# EAGLE design LilyPad-Dev-Simple-v12 (EAGLE 6.2)

## Sheet 1 of 2
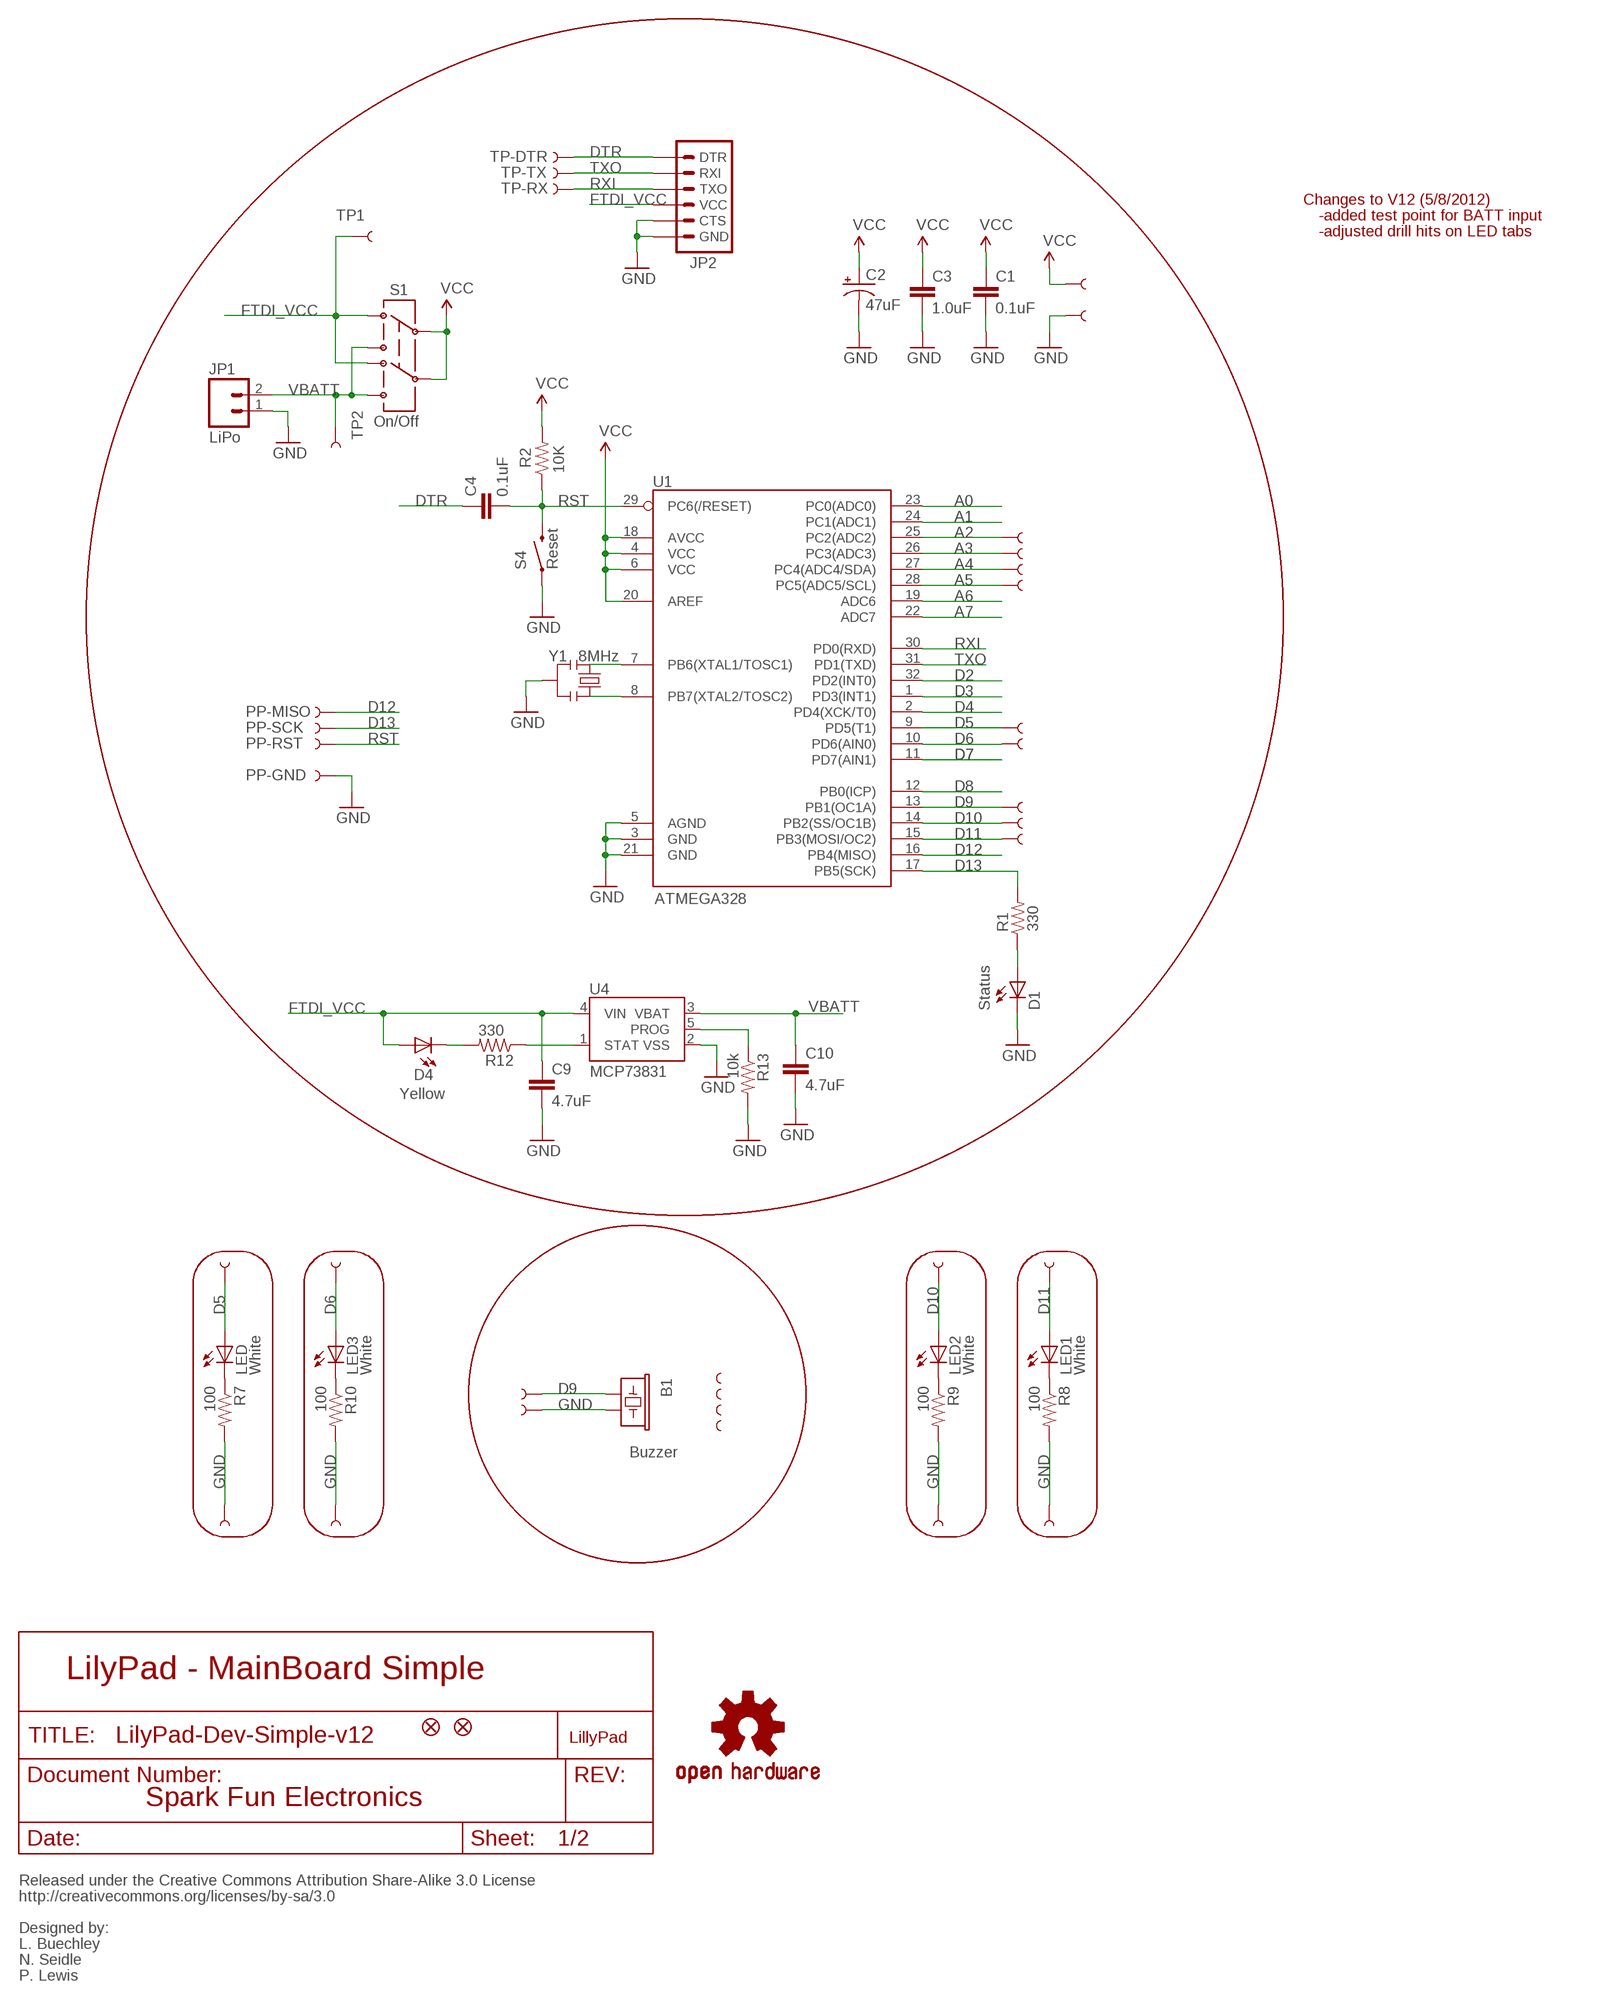
[diagram p0: schematic, sheet 1]

### Parts
1  SEWTAP-NOHOLE2  [PETAL-NOHOLE-2SIDE]
2  SEWTAP-NOHOLE2  [PETAL-NOHOLE-2SIDE]
3  SEWTAP-NOHOLE2  [PETAL-NOHOLE-2SIDE]
4  SEWTAP-NOHOLE2  [PETAL-NOHOLE-2SIDE]
A2/16  SEWTAP9  [PETAL-LONG-1-2SIDE]
A3/17  SEWTAP9  [PETAL-LONG-1-2SIDE]
A4/18  SEWTAP9  [PETAL-LONG-1-2SIDE]
A5/19  SEWTAP9  [PETAL-LONG-1-2SIDE]
B1  Buzzer  BUZZERSMD2  [BUZZER-CCV]
C1  0.1uF  CAP0402-CAP  [0402-CAP]
C2  47uF  CAP_POL3528  [EIA3528]
C3  1.0uF  CAP0402-CAP  [0402-CAP]
C4  0.1uF  CAP0402-CAP  [0402-CAP]
C9  4.7uF  CAP0402-CAP  [0402-CAP]
C10  4.7uF  CAP0402-CAP  [0402-CAP]
D1  Status  LED0603  [LED-0603]
D4  Yellow  LED0603  [LED-0603]
JP1  LiPo  M02-JST-2MM-SMT  [JST-2-SMD]
JP2  ARDUINO_SERIAL_PROGRAMSMD  [1X06-SMD]
JP3  FIDUCIAL1X2  [FIDUCIAL-1X2]
JP4  FIDUCIAL1X2  [FIDUCIAL-1X2]
LED  White  LED1206  [LED-1206]
LED1  White  LED1206  [LED-1206]
LED2  White  LED1206  [LED-1206]
LED3  White  LED1206  [LED-1206]
LED+  SEWTAP6  [PETAL-SMALL-2SIDE]
LED+1  SEWTAP6  [PETAL-SMALL-2SIDE]
LED+2  SEWTAP6  [PETAL-SMALL-2SIDE]
LED+3  SEWTAP6  [PETAL-SMALL-2SIDE]
LED-  SEWTAP6  [PETAL-SMALL-2SIDE]
LED-1  SEWTAP6  [PETAL-SMALL-2SIDE]
LED-2  SEWTAP6  [PETAL-SMALL-2SIDE]
LED-3  SEWTAP6  [PETAL-SMALL-2SIDE]
LOGO  LOGO-LPLPA  [LOGO-LPA]
PP-GND  TEST-POINT3X5  [PAD.03X.05]
PP-MISO  TEST-POINT3X5  [PAD.03X.05]
PP-RST  TEST-POINT3X5  [PAD.03X.05]
PP-SCK  TEST-POINT3X5  [PAD.03X.05]
R1  330  RESISTOR0402-RES  [0402-RES]
R2  10K  RESISTOR0402-RES  [0402-RES]
R7  100  RESISTOR0603-RES  [0603-RES]
R8  100  RESISTOR0603-RES  [0603-RES]
R9  100  RESISTOR0603-RES  [0603-RES]
R10  100  RESISTOR0603-RES  [0603-RES]
R12  330  RESISTOR0402-RES  [0402-RES]
R13  10k  RESISTOR0402-RES  [0402-RES]
S1  On/Off  AYZ0202  [AYZ0202]
S4  Reset  SWITCH-MOMENTARY-2SMD  [TACTILE_SWITCH_SMD]
TP1  TEST-POINT3X5  [PAD.03X.05]
TP2  TEST-POINT3X5  [PAD.03X.05]
TP-DTR  TEST-POINT3X5  [PAD.03X.05]
TP-RX  TEST-POINT3X5  [PAD.03X.05]
TP-TX  TEST-POINT3X5  [PAD.03X.05]
U1  ATMEGA328  ATMEGA168  [TQFP32-08]
U4  MCP73831  [SOT23-5]
U$1  SEWTAP9  [PETAL-LONG-1-2SIDE]
U$2  OSHW-LOGOS  [OSHW-LOGO-S]
U$4  SEWTAP9  [PETAL-LONG-1-2SIDE]
U$32-  SEWTAP6  SEWTAP4  [PETAL-SMALL]
U$33+  SEWTAP6  SEWTAP4  [PETAL-SMALL]
U$37  SEWTAP9  [PETAL-LONG-1-2SIDE]
U$39  SEWTAP9  [PETAL-LONG-1-2SIDE]
U$41  SEWTAP9  [PETAL-LONG-1-2SIDE]
U$43  SEWTAP9  [PETAL-LONG-1-2SIDE]
U$45  SEWTAP9  [PETAL-LONG-1-2SIDE]
Y1  8MHz  RESONATORSMD  [RESONATOR-SMD]

### Nets
A0: U1.23(PC0(ADC0))
A1: U1.24(PC1(ADC1))
A2: A2/16.1 U1.25(PC2(ADC2))
A3: A3/17.1 U1.26(PC3(ADC3))
A4: A4/18.1 U1.27(PC4(ADC4/SDA))
A5: A5/19.1 U1.28(PC5(ADC5/SCL))
A6: U1.19(ADC6)
A7: U1.22(ADC7)
D2: U1.32(PD2(INT0))
D3: U1.1(PD3(INT1))
D4: U1.2(PD4(XCK/T0))
D5: LED+.1 LED.A U1.9(PD5(T1)) U$41.1
D6: LED3.A LED+3.1 U1.10(PD6(AIN0)) U$1.1
D7: U1.11(PD7(AIN1))
D8: U1.12(PB0(ICP))
D9: B1.+ U1.13(PB1(OC1A)) U$33+.1 U$37.1
D10: LED2.A LED+2.1 U1.14(PB2(SS/OC1B)) U$39.1
D11: LED1.A LED+1.1 U1.15(PB3(MOSI/OC2)) U$4.1
D12: PP-MISO.P$1 U1.16(PB4(MISO))
D13: PP-SCK.P$1 R1.2 U1.17(PB5(SCK))
DTR: C4.1 JP2.1(DTR) TP-DTR.P$1
FTDI_VCC: C9.1 D4.A JP2.4(VCC) S1.3 S1.6 TP1.P$1 U4.4(VIN)
GND [VCC]: B1.- C1.2 C2.C(-) C3.2 C9.2 C10.2 D1.C JP1.1 JP2.5(CTS) JP2.6(GND) LED-1.1 LED-2.1 LED-3.1 LED-.1 PP-GND.P$1 R7.2 R8.2 R9.2 R10.2 R13.2 S4.1 U1.3(GND) U1.5(AGND) U1.21(GND) U4.2(VSS) U$32-.1 U$43.1 Y1.2
N$1: U1.7(PB6(XTAL1/TOSC1)) Y1.1
N$2: D1.A R1.1
N$3: U1.8(PB7(XTAL2/TOSC2)) Y1.3
N$18: LED.C R7.1
N$21: LED1.C R8.1
N$24: LED2.C R9.1
N$27: LED3.C R10.1
N$33: D4.C R12.2
PROG: R13.1 U4.5(PROG)
RST: C4.2 PP-RST.P$1 R2.1 S4.3 U1.29(PC6(/RESET))
RXI: JP2.3(TXO) TP-RX.P$1 U1.30(PD0(RXD))
STAT: R12.1 U4.1(STAT)
TXO: JP2.2(RXI) TP-TX.P$1 U1.31(PD1(TXD))
VBATT: C10.1 JP1.2 S1.1 S1.4 TP2.P$1 U4.3(VBAT)
VCC [VCC]: C1.1 C2.A(+) C3.1 R2.2 S1.2 S1.5 U1.4(VCC) U1.6(VCC) U1.18(AVCC) U1.20(AREF) U$45.1

### Notes on the sheet
- Changes to V12 (5/8/2012)
- -added test point for BATT input
- -adjusted drill hits on LED tabs
- LilyPad - MainBoard Simple
- Spark Fun Electronics
- Released under the Creative Commons Attribution Share-Alike 3.0 License
- http://creativecommons.org/licenses/by-sa/3.0
- Designed by:
- L. Buechley
- N. Seidle
- P. Lewis

## Sheet 2 of 2

## Library data of the parts
1-4 = LilyPad-Wearables:SEWTAP-NOHOLE
A2/16 A3/17 A4/18 A5/19 LED+ LED+1-LED+3 LED- LED-1-LED-3 U$1 U$4 U$32- U$33+ U$37 U$39 U$41 U$43 U$45 = LilyPad-Wearables:SEWTAP
B1 = SparkFun:BUZZER: Buzzer 12mm Spark Fun Electronics SKU : Comp-Buzzer
C1 C3 C4 C9 C10 = SparkFun:CAP: Capacitor Standard 0603 ceramic capacitor, and 0.1" leaded capacitor.
C2 = SparkFun:CAP_POL: Capacitor Polarized These are standard SMD and PTH capacitors. Normally 10uF, 47uF, and 100uF in electrolytic and tantalum varieties. Always verify the external diameter of the through hole cap, it varies with capacity, voltage, and manufacturer. The EIA devices should be standard.
D1 D4 = SparkFun:LED: LEDs
JP1 = SparkFun:M02: Header 2 Standard 2-pin 0.1" header. Use with straight break away headers (SKU : PRT-00116), right angle break away headers (PRT-00553), swiss pins (PRT-00743), machine pins (PRT-00117), and female headers (PRT-00115). Molex polarized connector foot print use with SKU : PRT-08233 with associated crimp pins and housings.
JP2 = SparkFun:ARDUINO_SERIAL_PROGRAM
JP3 JP4 = SparkFun:FIDUCIAL: Fiducial Alignment Points Various fiducial points for machine vision alignment.
LED LED1-LED3 = SparkFun-3-2-07:LED: LEDs
LOGO = LilyPad-Wearables:LOGO-LP
PP-GND PP-MISO PP-RST PP-SCK TP1 TP2 TP-DTR TP-RX TP-TX = SparkFun:TEST-POINT
R1 R2 R7-R10 R12 R13 = SparkFun:RESISTOR: Resistor Basic schematic elements and footprints for 0603, 1206, and PTH resistors.
S1 = SparkFun:AYZ0202: SPDT Slide Switch Simple SMD single-pull double-throw slide switch. Good for less than 350mA power switch, switching UARTs between devices, etc. Spark Fun Electronics SKU : COM-00597
S4 = SparkFun:SWITCH-MOMENTARY-2
U1 = SparkFun:ATMEGA168
U4 = SparkFun:MCP73831: Microchip's MCP73831 Miniature single cell, fully integrated Li-Ion, Li-polymer charge management controller http://ww1.microchip.com/downloads/en/DeviceDoc/21984a.pdf
U$2 = SparkFun:OSHW-LOGO: Open Source Hardware Logo This logo indicates the piece of hardware it is found on incorporates a OSHW license and/or adheres to the definition of open source hardware found here: http://freedomdefined.org/OSHW
Y1 = SparkFun:RESONATOR: Resonator Small SMD resonator. This is the itty bitty 10/20MHz resonators with built in caps. CSTCE10M0G55 and CSTCE20M0V53. Footprint has been reviewed closely but hasn't been tested yet.

## Net classes
1 VCC: width 0.203 mm

## Board
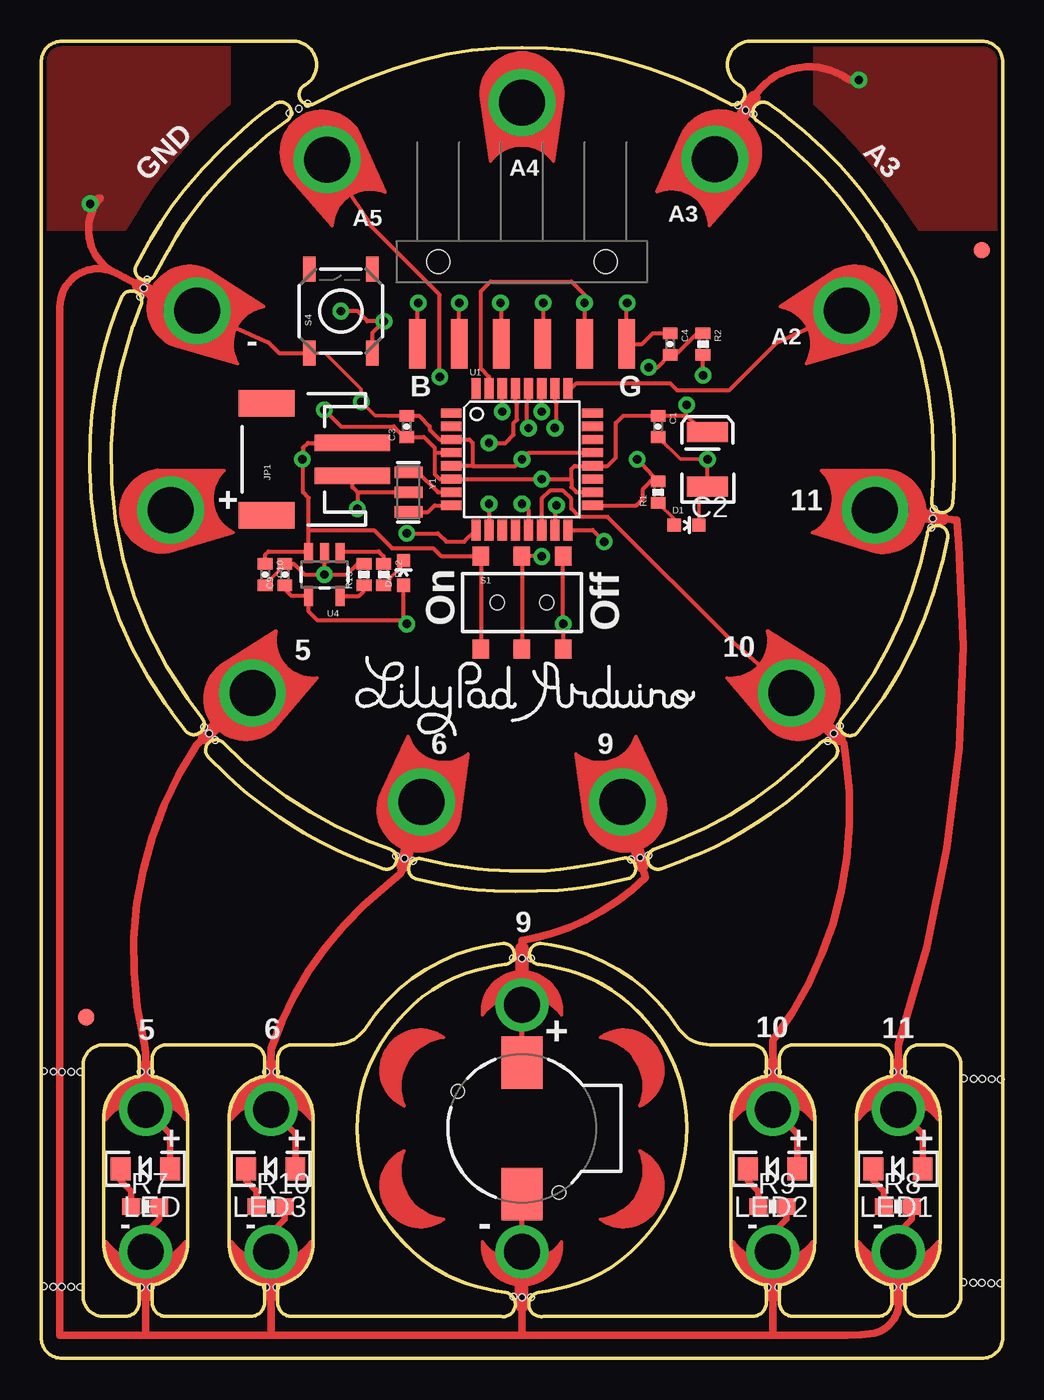
[diagram p1: board, top side]
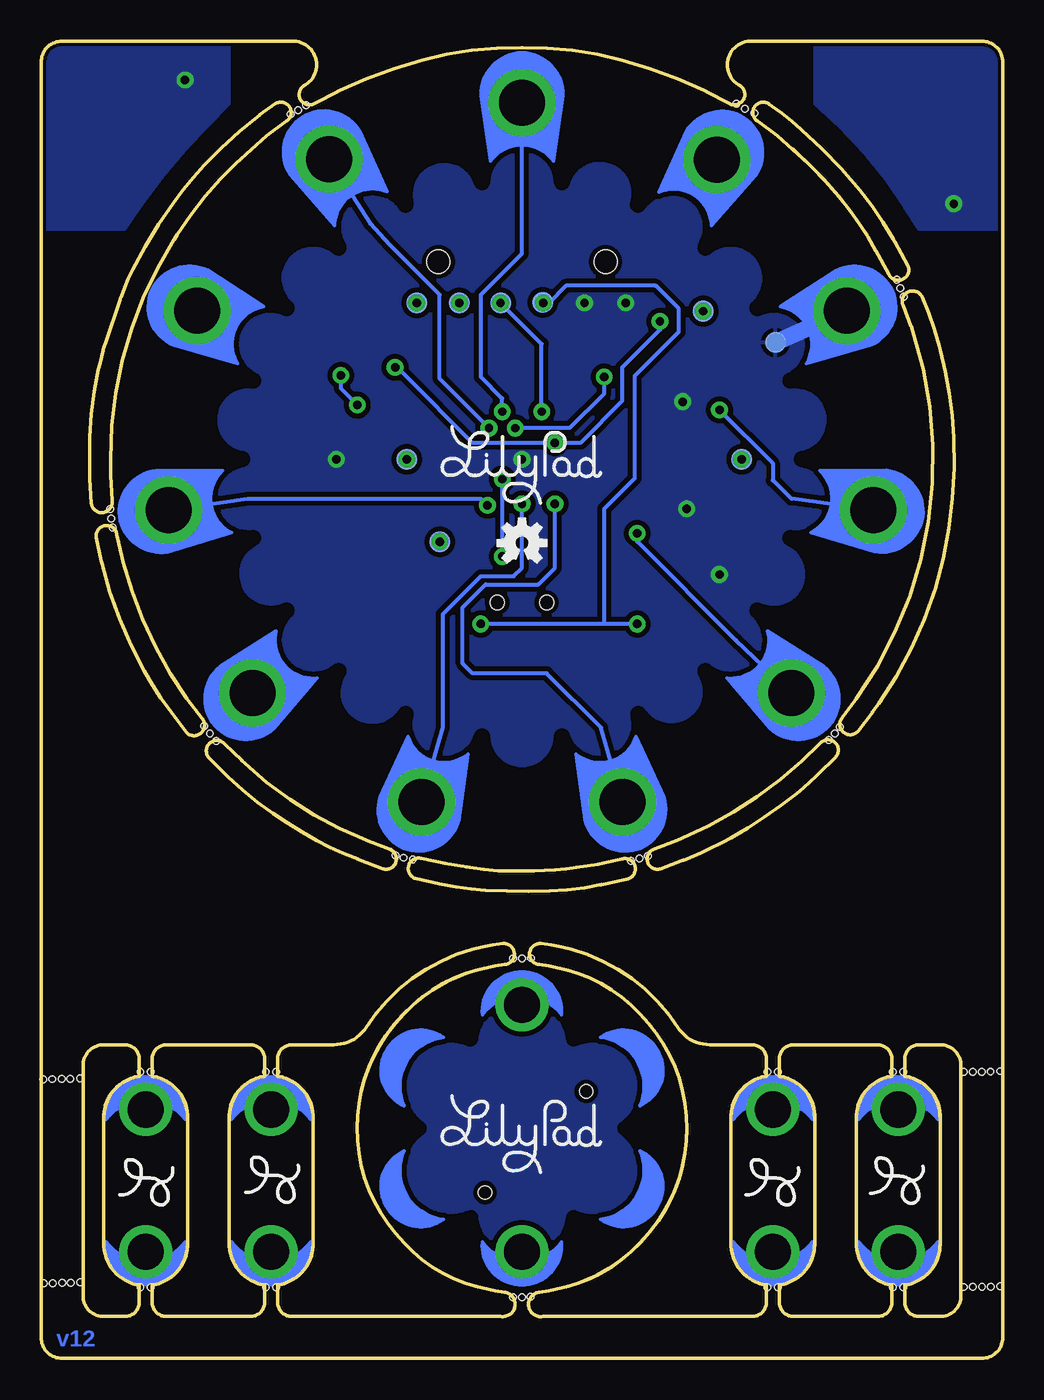
[diagram p2: board, bottom side, seen from below]

Size 58.42 x 80.01 mm. Coordinates in mm from the lower left corner, seen from the top.
Outline: 27.94,2.54 26.67,2.54 16.51,2.54
Outline: 54.2,54.63 arc33 50.34,67.97
Outline: 8.89,14.68 arc65 7.49,16.89 arc-65 8.89,14.68
Outline: 3.81,14.55 arc-64 5.05,16.82
Outline: 5.21,4.7 arc-65 3.81,6.91 3.81,14.55
Outline: 39.22,14.02 arc30 37.95,18.87 arc33 33.76,22.89 arc11 32.03,23.57
Outline: 39.22,14.02 arc-33 37.77,8.81
Outline: 37.77,8.81 arc-15 35.84,6.48
Outline: 35.84,6.48 arc-29 31.9,4.34 arc29 35.84,6.48
Outline: 19.2,13.92 arc30 20.47,9.07
Outline: 20.47,9.07 arc33 24.66,5.05
Outline: 24.66,5.05 arc11 26.52,4.34 arc-29 22.58,6.48 arc-15 20.65,8.81 arc-33 19.2,14.02
Outline: 19.2,13.92 arc-33 20.65,19.13
Outline: 20.65,19.13 arc-15 22.58,21.46 arc-29 26.52,23.6
Outline: 45.82,80.01 57.15,80.01 arc-90 58.42,78.74 58.42,1.27 arc-90 57.15,0 1.27,0 arc-90 0,1.27 0,78.74 arc-90 1.27,80.01 12.6,80.01
Outline: 45.72,80.01 43.18,80.01 arc155 42.48,77.3
Outline: 30.5,2.54 31.75,2.54 43.18,2.54 arc90 44.06,3.42 44.06,4.46 arc-20 43.4,4.65 43.22,4.74 arc-64 41.91,7.04
Outline: 3.81,19.05 arc-1 4.19,19.05
Outline: 58.42,5.08 58.42,16.51
Outline: 3.81,19.05 arc90 2.54,17.78 2.54,3.81 arc90 3.81,2.54 5.08,2.54 arc90 5.96,3.42 5.96,4.46 arc-20 5.3,4.65 5.12,4.74 arc-64 3.81,7.04
Outline: 8.56,19.05 11.43,19.05
Outline: 7.72,67.28 6.93,65.85 arc-180 5.78,66.39 6.56,67.83
Outline: 5.58,62.7 6.05,63.94 arc180 4.9,64.47
Outline: 19.78,31.47 21.16,30.95 arc-180 20.79,29.73 19.41,30.26
Outline: 24.63,30 23.14,30.34 arc180 22.77,29.12 24.27,28.79
Outline: 24.26,28.79 24.41,28.77
Outline: 8.88,40.11 9.75,38.93 arc-180 8.79,38.1 7.9,39.27
Outline: 12.2,36.29 11.11,37.36 arc180 10.15,36.53 11.24,35.45
Outline: 11.24,35.46 11.35,35.36
Outline: 33.87,30.06 35.3,30.36 arc-180 35.67,29.14 34.22,28.82
Outline: 38.72,31.49 37.3,30.95 arc180 37.66,29.73 39.09,30.28
Outline: 39.08,30.28 39.22,30.34
Outline: 46.22,36.3 47.27,37.32 arc-180 48.23,36.48 47.17,35.45
Outline: 49.57,40.09 48.65,38.87 arc180 49.6,38.03 50.52,39.26
Outline: 50.52,39.26 50.61,39.38
Outline: 53.5,48.61 53.82,50.04 arc-180 55.08,49.87 54.77,48.42
Outline: 54.21,53.62 54.11,52.1 arc180 55.37,51.92 55.46,53.45
Outline: 55.46,53.45 55.47,53.59
Outline: 44.71,74.26 43.53,75.13 arc-180 44.2,76.21 45.14,75.53
Outline: 40.42,76.94 41.77,76.24 arc180 42.45,77.31
Outline: 26.38,23.56 arc-2 27.58,23.84 arc-9 28.14,23.91 arc183 28.05,25.19 arc10 26.18,24.85 arc41 19.76,20.12 arc-57 17.78,19.05 15.24,19.05 arc90 14.36,18.17 14.36,17.13 arc-20 15.02,16.94 15.2,16.86 arc-64 16.51,14.55
Outline: 39.22,13.92 arc33 37.77,19.13 arc15 35.84,21.46 arc29 31.9,23.6
Outline: 41.91,19.05 40.64,19.05 arc-57 38.66,20.12 arc41 32.23,24.85 arc10 30.37,25.19 arc183 30.28,23.91 arc-9 30.84,23.84 arc-2 32.04,23.56
Outline: 19.2,13.92 arc30 20.47,9.07
Outline: 20.47,9.07 arc33 24.66,5.05
Outline: 24.66,5.05 arc11 26.39,4.37
Outline: 19.2,13.92 arc-33 20.65,19.13
Outline: 39.22,14.02 arc-33 37.77,8.81
Outline: 37.77,8.81 arc-15 35.84,6.48
Outline: 30.5,2.54 arc-183 30.28,4.03 arc9 30.84,4.1 arc2 32.04,4.38
Outline: 27.95,2.54 arc183 28.14,4.03 arc-9 27.58,4.1 arc-2 26.38,4.38
Outline: 6.56,67.81 6.65,67.98 arc-9 8.69,70.97 arc-10 12.24,74.62
Outline: 45.15,75.52 45.27,75.43 arc-9 48.51,72.46 arc-7 50.37,70.2 arc-9 52.87,66.12 arc-8 53.56,64.47 arc7 53.63,64.31
Outline: 3.81,14.55 arc-64 5.12,16.86 5.3,16.94 arc-20 5.96,17.13 5.96,18.17 arc90 5.08,19.05 3.81,19.05
Outline: 8.89,14.68 8.89,7.04 arc-64 7.58,4.74 7.4,4.65 arc-20 6.74,4.46 6.74,3.42 arc90 7.62,2.54 12.7,2.54 arc90 13.58,3.42 13.58,4.46 arc-20 12.92,4.65 12.74,4.74 arc-64 11.43,7.04
Outline: 8.89,14.55 arc64 7.58,16.86 7.4,16.94 arc20 6.74,17.13 6.74,18.17 arc-90 7.62,19.05 8.89,19.05
Outline: 16.51,14.68 arc65 15.11,16.89 arc-65 16.51,14.68
Outline: 11.43,14.55 arc-64 12.68,16.82
Outline: 12.83,4.7 arc-65 11.43,6.91 11.43,14.55
Outline: 11.43,19.05 arc-1 11.81,19.05
Outline: 19.05,2.54 15.24,2.54 arc-90 14.36,3.42 14.36,4.46 arc20 15.02,4.65 15.2,4.74 arc64 16.51,7.04 16.51,14.68
Outline: 11.43,14.55 arc-64 12.74,16.86 12.92,16.94 arc-20 13.58,17.13 13.58,18.17 arc90 12.7,19.05 11.43,19.05
Outline: 46.99,14.68 arc65 45.59,16.89 arc-65 46.99,14.68
Outline: 41.91,14.55 arc-64 43.15,16.82
Outline: 43.31,4.7 arc-65 41.91,6.91 41.91,14.55
Outline: 41.91,19.05 arc-1 42.29,19.05
Outline: 41.91,14.55 arc-64 43.22,16.86 43.4,16.94 arc-20 44.06,17.13 44.06,18.17 arc90 43.18,19.05 41.91,19.05
Outline: 46.99,14.68 46.99,7.04 arc-64 45.68,4.74 45.5,4.65 arc-20 44.84,4.46 44.84,3.42 arc90 45.72,2.54 50.8,2.54 arc90 51.68,3.42 51.68,4.46 arc-20 51.02,4.65 50.84,4.74 arc-64 49.53,7.04
Outline: 46.99,14.55 arc64 45.68,16.86 45.5,16.94 arc20 44.84,17.13 44.84,18.17 arc-90 45.72,19.05 49.53,19.05
Outline: 54.61,14.68 arc65 53.21,16.89 arc-65 54.61,14.68
Outline: 49.53,14.55 arc-64 50.77,16.82
Outline: 50.93,4.7 arc-65 49.53,6.91 49.53,14.55
Outline: 49.53,19.05 arc-1 49.91,19.05
Outline: 49.53,14.55 arc-64 50.84,16.86 51.02,16.94 arc-20 51.68,17.13 51.68,18.17 arc90 50.8,19.05 49.53,19.05
Outline: 54.61,14.68 54.61,7.04 arc-64 53.3,4.74 53.12,4.65 arc-20 52.46,4.46 52.46,3.42 arc90 53.34,2.54 54.61,2.54 arc90 55.88,3.81 55.88,17.78 arc90 54.61,19.05 53.34,19.05 arc90 52.46,18.17 52.46,17.13 arc-20 53.12,16.94 53.3,16.86 arc-64 54.61,14.55
Outline: 54.59,61.44 arc-11 54.66,61.25 arc-1 54.94,60.06 arc-15 55.48,54.59 arc2 55.46,53.55
Outline: 54.77,48.42 54.72,48.23 arc-15 52.15,41.75 arc-8 50.59,39.34
Outline: 47.19,35.45 47.05,35.32 arc-11 44.33,33.1 arc-5 41.69,31.47 arc-9 39.18,30.32
Outline: 34.23,28.83 34.08,28.8 arc-10 31.43,28.43 arc-5 27.53,28.39 arc-10 24.37,28.77
Outline: 32.6,29.85 32.36,29.81 arc-9 29.78,29.6 arc-2 27.84,29.63 arc-6 25.9,29.82
Outline: 19.41,30.26 19.2,30.34 arc-5 17.9,30.91 17.04,31.34 arc-6 15.48,32.22 arc-6 12.52,34.31 arc-7 11.34,35.37
Outline: 7.92,39.25 7.53,39.79 arc-23 3.61,48.59 arc-15 2.98,55.92 arc-12 3.8,61.25
Outline: 12.74,73.43 12.58,73.29 arc6 9.95,70.55 arc13 7.71,67.25
Outline: 40.44,76.93 40.26,77.02 arc10 35.29,78.85 arc16 29.19,79.61
Outline: 50.34,67.96 50.15,68.25 arc12 47.51,71.65 arc6 44.71,74.26
Outline: 54.21,53.62 54.21,54.62
Outline: 53.5,48.6 53.44,48.34 arc-21 49.57,40.08
Outline: 46.23,36.32 46.02,36.12 arc-22 38.69,31.48
Outline: 33.89,30.06 32.56,29.84
Outline: 25.92,29.82 24.6,30.01
Outline: 19.8,31.47 19.45,31.61 arc-20 12.19,36.29
Outline: 5.57,62.7 5.46,62.36 arc54 8.9,40.07
Outline: 12.7,80.01 15.24,80.01 arc-155 15.94,77.3
Outline: 13.71,74.26 14.89,75.13 arc180 14.21,76.21
Outline: 18,76.94 16.64,76.24 arc-180 15.97,77.31
Outline: 17.98,76.93 18.16,77.02 arc-10 23.13,78.85 arc-16 29.23,79.61
Outline: 8.27,68.25 arc-12 10.91,71.65 arc-6 13.71,74.26
Outline: 14.2,76.19 14.03,76.07 arc8 12.24,74.63
Outline: 54.61,61.4 54.51,61.7 53.63,64.31
Outline: 3.79,61.24 3.86,61.49 arc-8 4.89,64.47
Copper layers (1*16): Top 0.035mm / dielectric 1.5mm / Bottom 0.035mm
Design rules: minimum track width 8mil, minimum drill 20mil, track to track 8mil, track to pad 8mil, pad to pad 8mil, via to via 8mil, smd to smd 8mil, copper to edge 8mil, drill to drill 8mil, minimum pad ring 12mil, minimum via ring 10mil, stop-mask expansion 4mil, vias tented up to drill 20mil, thermal gap 10mil
Holes 0.38 mm at 6.24,65.02 6.45,65.52 6.01,64.48 42.8,75.82 43.26,75.56 42.32,76.13 54.16,51.02 54.22,51.58 54.07,50.46 48.17,37.96 48.52,38.41 47.78,37.5 36.39,30.41 36.9,30.55 35.84,30.3 22.09,30.37 22.58,30.23 21.56,30.51 10.2,37.95 10.56,37.57 9.89,38.35 29.21,24.28 29.75,24.29 28.65,24.31 29.21,3.72 29.75,3.71 28.69,3.74 2.38,17.39 1.83,17.4 1.26,17.41 0.75,17.42 0.15,17.45 2.37,4.33 1.83,4.34 1.26,4.35 0.74,4.36 0.15,4.39 58.29,16.95 57.74,16.96 57.18,16.97 56.66,16.97 56.06,17.01 58.26,4.56 57.71,4.57 57.15,4.58 56.63,4.58 56.03,4.62 15.66,75.91 16.19,76.22 15.1,75.63 6.67,17.41 6.04,17.41 14.29,17.41 13.66,17.41 44.77,17.41 44.13,17.41 52.39,17.41 51.75,17.41 6.67,4.33 6.04,4.33 14.29,4.33 13.66,4.33 44.77,4.33 44.13,4.33 52.39,4.33 51.75,4.33
bRestrict: area 6.6,32 to 51.8,77.2; area 25.2,72.4 to 27.7,73.6; area 35.8,70.9 to 38.6,72.6; area 40.5,68 to 43.1,70.3; area 44.2,63.7 to 46.2,66.5; area 46.4,58.8 to 47.8,61.4; area 47,53.5 to 48.2,55.8; area 46.4,47.8 to 47.9,50.5; area 40.5,39 to 43.2,41.3; area 35.9,36.6 to 38.7,38.3; area 30.7,35.6 to 33.1,36.9; area 25.3,35.6 to 27.8,36.9; area 19.8,36.6 to 22.5,38.3; area 15.2,38.9 to 18,41.2; area 12.2,42.7 to 14.3,45.5; area 10.6,47.8 to 12.2,50.4; area 10.2,53.3 to 11.4,55.8; area 10.5,58.7 to 12.1,61.3; area 12.2,63.6 to 14.3,66.5; area 15.2,67.9 to 17.9,70.2; area 19.6,70.8 to 22.6,72.6; area 30.6,72.1 to 33.3,73.6; area 44.2,42.6 to 46.2,45.7; 22 lines

### Footprints (pad centres in the part's own frame; a part is rotated, then mirrored left to right if it is on the bottom)
PETAL-LONG-1-2SIDE = drill 2.794 pad 4.064: 1 0.03,0
BUZZER-CCV = smd 3.2 x 2.5: + 4,0; - -4,0 | hole 0.8: -3.9,-2.25; 2.25,3.9
0402-CAP = smd 0.7 x 0.9: 1 -0.65,0; 2 0.65,0
EIA3528 = smd 1.2 x 2.5: A 1.65,0; C -1.65,0
LED-0603 = smd 0.8 x 0.8: A 0,-0.75; C 0,0.75
JST-2-SMD = smd 1 x 4.6: 1 -1,-3.7; 2 1,-3.7 | smd 1.6 x 3.4: NC1 -3.4,1.5; NC2 3.4,1.5
1X06-SMD = smd 1 x 3: 1 -6.35,5; 2 -3.81,5; 3 -1.27,5; 4 1.27,5; 5 3.81,5; 6 6.35,5 | hole 1.4: -5.08,0; 5.08,0
FIDUCIAL-1X2 = smd 1 x 1: 1 0,0
LED-1206 = smd 1.2 x 1.4: A -1.5,0; C 1.5,0
PETAL-SMALL-2SIDE = drill 2.2: 1 0,0
PAD.03X.05 = smd 1.27 x 1.27: P$1 0,0
0402-RES = smd 0.7 x 0.9: 1 -0.65,0; 2 0.65,0
0603-RES = smd 1.1 x 1: 1 -0.85,0; 2 0.85,0
AYZ0202 = smd 1 x 1.15: 1 -2.5,2.825; 2 0,2.825; 3 2.5,2.825; 4 -2.5,-2.825; 5 0,-2.825; 6 2.5,-2.825 | hole 0.85: 1.5,0; -1.5,0
TACTILE_SWITCH_SMD = smd 1.524 x 0.762: 1 -2.54,1.905; 2 2.54,1.905; 3 -2.54,-1.905; 4 2.54,-1.905
TQFP32-08 = smd 1.27 x 0.559: 1 -4.293,2.8; 2 -4.293,2; 3 -4.293,1.2; 4 -4.293,0.4; 5 -4.293,-0.4; 6 -4.293,-1.2; 7 -4.293,-2; 8 -4.293,-2.8; 17 4.293,-2.8; 18 4.293,-2; 19 4.293,-1.2; 20 4.293,-0.4; 21 4.293,0.4; 22 4.293,1.2; 23 4.293,2; 24 4.293,2.8 | smd 0.559 x 1.27: 9 -2.8,-4.293; 10 -2,-4.293; 11 -1.2,-4.293; 12 -0.4,-4.293; 13 0.4,-4.293; 14 1.2,-4.293; 15 2,-4.293; 16 2.8,-4.293; 25 2.8,4.293; 26 2,4.293; 27 1.2,4.293; 28 0.4,4.293; 29 -0.4,4.293; 30 -1.2,4.293; 31 -2,4.293; 32 -2.8,4.293
SOT23-5 = smd 0.55 x 1.2: 1 -0.95,-1.3; 2 0,-1.3; 3 0.95,-1.3; 4 0.95,1.3; 5 -0.95,1.3
RESONATOR-SMD = smd 0.7 x 1.7: 1 -1.2,0; 2 0,0; 3 1.2,0

### Placement (x,y rotation side)
1  22.71,10.22 300 top
2  22.71,17.72 240 top
3  35.71,17.72 120 top
4  35.71,10.22 60 top
A2/16  48.98,63.65 204.5 top
A3/17  40.95,72.87 237.3 top
A4/18  29.21,76.31 270 top
A5/19  17.34,72.85 302.7 top
B1  29.21,13.97 90 top
C1  37.48,56.61 270 top
C2  40.48,54.61 90 top
C3  22.21,56.61 90 top
C4  38.21,61.61 270 top
C9  14.81,47.61 90 top
C10  13.61,47.61 270 top
D1  39.21,50.61 270 top
D4  22.01,47.71 0 top
JP1  15.21,54.61 90 top
JP2  29.21,66.61 180 top
JP3  57.15,67.31 0 top
JP4  2.74,20.73 0 top
LED  6.33,11.51 180 top
LED1  52.05,11.51 180 top
LED2  44.43,11.51 180 top
LED3  13.95,11.51 180 top
LED+  6.35,15.11 180 top
LED+1  52.07,15.11 180 top
LED+2  44.45,15.11 180 top
LED+3  13.97,15.11 180 top
LED-  6.35,6.48 0 top
LED-1  52.07,6.48 0 top
LED-2  44.45,6.48 0 top
LED-3  13.97,6.48 0 top
LOGO  29.21,40.61 0 top
LOGO3  LOGO-LPL  [LOGO-L]  6.43,10.79 90 bottom
LOGO4  LOGO-LPL  [LOGO-L]  52.02,10.69 90 bottom
LOGO5  LOGO-LPL  [LOGO-L]  44.37,10.85 90 bottom
LOGO6  LOGO-LPL  [LOGO-L]  14,10.69 90 bottom
PP-GND  13.81,61.71 0 bottom
PP-MISO  34.21,49.61 0 bottom
PP-RST  18.21,63.61 0 bottom
PP-SCK  36.21,54.61 0 bottom
R1  37.48,52.61 90 top
R2  40.21,61.61 270 top
R7  6.33,9.22 0 top
R8  52.05,9.22 0 top
R9  44.43,9.22 0 top
R10  13.95,9.22 0 top
R12  20.81,47.61 270 top
R13  19.61,47.61 90 top
S1  29.21,45.91 0 top
S4  18.21,63.61 90 top
TP1  27.94,64.14 0 bottom
TP2  15.88,54.61 0 bottom
TP-DTR  35.61,64.11 0 bottom
TP-RX  30.51,64.11 0 bottom
TP-TX  33.01,64.11 90 bottom
U1  29.21,54.61 0 top
U4  17.21,47.61 180 top
U$1  23.1,33.78 73.7 top
U$2  29.21,49.53 0 bottom
U$4  50.69,51.52 171.8 top
U$21  LOGO-LPLP  [LOGO-LILYPAD]  29.21,54.61 0 bottom
U$32-  SEWTAP6  [PETAL-SMALL-2SIDE]  29.21,6.47 0 top
U$33+  SEWTAP6  [PETAL-SMALL-2SIDE]  29.21,21.47 180 top
U$35  LOGO-LPLP  [LOGO-LILYPAD]  29.21,13.97 0 bottom
U$36  [LILYPAD-BRD-LAYERS-SMALL]  29.21,13.97 120 top
U$37  35.32,33.78 106.3 top
U$39  45.61,40.4 139.1 top
U$41  12.81,40.4 40.9 top
U$43  9.44,63.64 335.5 top
U$45  7.83,51.53 8.2 top
Y1  22.31,52.61 270 top

### Tracks (layer width: path | path; a pad name or v marks a point on that pad's centre or on a via)
A2
  Top 0.254: A2/16.1 44.71,61.71 41.81,58.81 38.62,58.81 38.2,59.23 32.52,59.23 32.1,58.81 U1.25
A3  (via drill 0.51)
  Top 0.254: U1.26 31.21,58.11 31.31,58.01 31.31,56.61 v31.21,56.51
  Top 0.457: A3/17.1 43.08,76.25 42.61,75.49 | 43.29,76.58 arc-93 48.96,77.73 arc39 v49.68,77.65
  Top 0.813: 42.61,75.49 43.29,76.58
  Bottom 0.254: A3/17.1 38.41,68.91 37.21,67.61 34.21,64.61 34.21,59.51 v31.21,56.51
  pour Top: 58.42,68.58 53.34,68.58 52.3,70.11 arc14 46.99,76.2 46.99,80.01 57.15,80.01 arc-90 58.42,78.74
  pour Bottom: 46.99,80.01 46.99,76.2 48.27,74.91 arc-12 53.34,68.58 58.42,68.58 58.42,78.74 arc90 57.15,80.01
A4  (via drill 0.51)
  Top 0.254: v30.41,57.51 U1.27
  Bottom 0.254: v30.41,57.51 30.41,58.31 31.71,59.61 31.71,64.61 29.21,67.11 A4/18.1
A5  (via drill 0.51)
  Top 0.254: A5/19.1 20.01,68.91 20.01,68.81 24.21,64.61 v24.21,59.61 | U1.28 29.61,58.21 29.51,58.11 29.51,56.61 v29.61,56.51
  Bottom 0.203: A5/19.1 15.86,71.32
  Bottom 0.254: v24.21,59.61 24.21,58.61 26.31,56.51 v29.61,56.51
D5  (via drill 0.51)
  Top 0.254: U1.9 25.7,49.61 24.61,49.61 24.11,50.11 v22.21,50.11
  Top 0.406: 6.35,15.24 LED+.1 7.83,13.63 LED.A
  Top 0.457: 9.94,37.71 9.46,37.27 arc47 6.22,19.3 arc-14 6.35,18.29 6.35,17.78 | 10.52,38.3 U$41.1 | LED+.1 6.35,17.06
  Top 0.813: 9.94,37.71 10.52,38.3 | 6.35,17.06 6.35,17.78
  Bottom 0.203: U$41.1 14.32,41.91
  Bottom 0.254: U$41.1 16.21,43.61 22.21,49.61 v22.21,50.11
D6  (via drill 0.51)
  Top 0.254: v27.21,51.91 U1.10
  Top 0.406: 13.97,15.24 LED+3.1 15.45,13.63 LED3.A
  Top 0.457: 21.98,29.94 21.84,29.46 20.96,28.7 arc33 13.97,18.8 13.96,17.79 | 22.23,30.8 U$1.1 | 13.97,15.24 13.96,17.12
  Top 0.813: 21.98,29.94 22.23,30.8 | 13.96,17.12 13.96,17.79
  Bottom 0.203: 29.21,41.61 28.79,41.61 | 30.48,41.61 29.63,41.61
  Bottom 0.254: v27.21,51.91 27.21,48.01 28.21,47.01 31.41,47.01 32.81,45.61 32.81,42.21 32.21,41.61 30.48,41.61 29.21,41.61 27.71,41.61 24.41,38.31 U$1.1
D9  (via drill 0.51)
  Top 0.254: U1.13 29.61,51.51 v29.21,51.91
  Top 0.305: U$33+.1 B1.+
  Top 0.457: 36.5,29.95 36.7,29.21 arc-32 29.97,25.53 29.21,25.4 29.21,24.89 | 36.22,30.82 U$37.1 | U$33+.1 29.22,24.78 29.21,23.57
  Top 0.813: 36.5,29.95 36.22,30.82 | 29.21,23.57 29.21,24.89
  Bottom 0.254: v29.21,51.91 29.21,48.01 29.71,47.51 31.71,47.51 34.01,45.21 34.01,38.31 U$37.1
D10
  Top 0.254: U$39.1 42.11,43.41 34.41,51.11 32.71,51.11 32.21,51.61 32.21,52.21 31.71,52.71 30.91,52.71 30.41,52.21 U1.14
  Top 0.406: 44.45,15.24 LED+2.1 45.93,13.63 LED2.A
  Top 0.457: 48.47,37.66 48.77,37.34 48.89,36.45 arc-45 44.45,19.3 44.46,17.92 | 47.84,38.29 U$39.1 | LED+2.1 44.44,17.2
  Top 0.813: 48.47,37.66 47.84,38.29 | 44.44,17.2 44.46,17.92
D11  (via drill 0.51)
  Top 0.254: U1.15 31.21,51.71 v31.31,51.81
  Top 0.406: 52.07,15.24 LED+1.1 53.55,13.63 LED1.A
  Top 0.457: 52.07,15.24 52.07,17.2 | 52.06,17.93 52.07,19.05 arc23 55.75,49.4 55.63,50.93 54.73,51.01 | 53.73,51.15 U$4.1
  Top 0.813: 52.07,17.2 52.06,17.93 | 54.73,51.01 53.73,51.15
  Bottom 0.254: v31.31,51.81 31.71,52.21 38.1,52.21 45.86,52.21 45.87,52.22 U$4.1
D12  (via drill 0.51)
  Top 0.254: U1.16 33.5,50.32 PP-MISO.P$1
  other vias: 34.21,49.61
D13  (via drill 0.51)
  Top 0.254: PP-SCK.P$1 R1.2 37.01,53.26 36.56,52.81 36.56,52.21 36.16,51.81 U1.17
  other vias: 36.21,54.61
DTR  (via drill 0.51)
  Top 0.254: TP-DTR.P$1 35.56,64.06 JP2.1 36.51,61.61 37.16,62.26 C4.1
  other vias: 35.61,64.11
FTDI_VCC  (via drill 0.51)
  Top 0.254: S1.3 v31.71,44.61 S1.6 | C9.1 14.81,46.71 15.21,46.31 U4.4 16.26,45.36 16.76,44.86 21.96,44.86 v22.21,44.61 22.01,44.81 D4.A | JP2.4 27.94,64.08 v27.91,64.11
  Bottom 0.254: v22.21,44.61 24.21,44.61 | 24.21,44.61 v31.71,44.61 | 24.21,44.61 24.21,51.61 22.35,53.47 22.35,59.69 19.68,62.36 19.68,63.75 21.08,65.15 26.54,65.15 27.58,64.11 v27.91,64.11 TP1.P$1
GND  (via drill 0.51)
  Top 0.203: C10.2 C9.2 | S4.1 17.25,61.07 19.45,58.87 v19.45,58.11 20.3,57.26 21.06,57.26 | C2.C 39.96,52.44 D1.C | v40.48,54.61 38.83,54.61 C1.2
  Top 0.254: U1.21 29.61,55.01 v29.21,54.61 28.81,54.21 26.21,54.21 | 26.21,54.21 U1.5 | 26.21,54.21 26.21,55.61 26.01,55.81 U1.3 24.21,55.81 23.61,56.41 23.61,56.61 22.96,57.26 C3.2 21.06,57.26 | U$43.1 PP-GND.P$1 14.45,61.07 S4.1 | v17.21,47.61 U4.2 | C2.C v40.48,54.61 | v17.21,47.61 18.56,47.61 19.21,48.26 R13.2 | C9.2 15.36,48.26 16.01,47.61 v17.21,47.61 | 19.21,52.61 Y1.2 | JP1.1 18.91,52.91 19.21,52.61 | 19.21,52.61 v19.21,51.61 | JP2.6 22.86,64.06 v22.91,64.11 | JP2.5 v25.4,64.1 v25.41,64.11
  Top 0.305: 30.13,9.88 B1.- U$32-.1 29.21,3.83 29.2,3.81
  Top 0.406: LED-.1 6.35,7.62 7.18,8.45 R7.2 | LED-1.1 52.07,7.62 52.9,8.45 R8.2 | LED-2.1 44.45,7.62 45.28,8.45 R9.2 | LED-3.1 13.97,7.62 14.8,8.45 R10.2
  Top 0.457: 52.06,3.55 52.07,3.81 arc-87 50.61,1.52 arc-6 48.13,1.4 44.45,1.4 | 52.07,4.48 52.07,7.62 | 6.35,1.4 1.14,1.4 1.14,63.88 arc-118 4.54,65.91 | 6.35,1.4 13.97,1.4 | 13.97,1.4 29.21,1.4 | 29.21,1.4 44.45,1.4 | 5.91,65.18 5.08,65.66 4.54,65.91 | 6.61,64.81 U$43.1 | 29.21,1.4 29.21,3.19 | 13.97,1.4 13.98,3.8 | 13.98,4.61 LED-3.1 | 6.35,1.4 6.35,3.81 | 6.34,4.59 LED-.1 | 44.45,1.4 44.45,3.77 | 44.45,4.43 LED-2.1 | 4.54,65.91 arc-106 3.59,70.48 arc45 v2.98,70.13
  Top 0.813: 52.06,3.55 52.07,4.48 | 5.91,65.18 6.61,64.81 | 29.21,3.19 29.2,3.81 29.19,4.38 | 13.98,3.8 13.98,4.61 | 6.35,3.81 6.34,4.59 | 44.45,3.77 44.45,4.43
  Bottom 0.203: U$43.1 10.52,64.68
  Bottom 1: U$43.1 PP-GND.P$1
  pour Bottom (isolate 0.305): 29.21,29.62 arc-90 4.22,54.61 4.22,54.64 arc-90 29.18,79.6 29.21,79.6 arc-90 54.2,54.61 54.2,54.58 arc-90 29.24,29.62
  pour Top: 11.43,76.2 11.43,80.01 1.27,80.01 arc90 0,78.74 0,68.58 5.08,68.58 5.99,70.04 arc-19
  pour Bottom: 11.43,80.01 1.27,80.01 arc90 0,78.74 0,68.58 5.08,68.58 5.94,69.94 arc-17 11.43,76.2
N$1
  Top 0.254: U1.7 24.11,52.61 22.91,53.81 Y1.1
N$2
  Top 0.203: R1.1 38.46,50.98 D1.A
N$3
  Top 0.254: U1.8 23.91,51.81 23.51,51.41 Y1.3
N$9
  pour Bottom (isolate 0.305): 24.22,22.67 24.11,22.61 arc90 20.46,9.01 20.59,8.79 arc90 33.95,5.21 34.21,5.36 arc90 37.88,19.07 arc90
N$18
  Top 0.254: 5.27,10.35 5.33,10.29
  Top 0.406: LED.C 4.83,10.79 5.27,10.35 5.48,10.14 R7.1
N$21
  Top 0.254: 50.99,10.35 51.05,10.29
  Top 0.406: LED1.C 50.55,10.79 50.99,10.35 51.2,10.14 R8.1
N$24
  Top 0.254: 43.37,10.35 43.43,10.29
  Top 0.406: LED2.C 42.93,10.79 43.37,10.35 43.58,10.14 R9.1
N$27
  Top 0.254: 12.89,10.35 12.95,10.29
  Top 0.406: LED3.C 12.45,10.79 12.89,10.35 13.1,10.14 R10.1
N$33
  Top 0.203: R12.2 21.71,47.91 22.01,48.21 D4.C
PROG
  Top 0.254: 18.56,46.31 U4.5 19.31,46.31 19.61,46.61 R13.1
RST  (via drill 0.51)
  Top 0.254: R2.1 39.86,62.26 38.56,60.96 C4.2 37.44,60.19 v36.91,60.19 | U1.29 28.81,58.11 28.91,58.01 28.91,57.01 28.71,56.81 28.71,56.11 28.21,55.61 v27.21,55.61 | PP-RST.P$1 19.21,63.61 19.83,62.99 v20.83,62.99 20.12,62.28 S4.3
  Bottom 0.254: v20.83,62.99 20.83,62.48 23.11,60.2 23.11,58.17 25.67,55.61 v27.21,55.61 32.21,55.61 36.31,59.71 36.79,60.19 v36.91,60.19
  other vias: 18.21,63.61
RXI  (via drill 0.51)
  Top 0.254: v28.01,57.51 U1.30 | JP2.3 30.48,64.08 TP-RX.P$1
  Bottom 0.254: v28.01,57.51 28.01,61.61 TP-RX.P$1
  other vias: 30.51,64.11
STAT
  Top 0.254: R12.1 20.81,48.71 20.51,49.01 18.26,49.01 U4.1
TXO  (via drill 0.51)
  Top 0.254: U1.31 27.21,59.61 26.71,60.11 26.71,64.81 27.31,65.41 32.21,65.41 33.01,64.61 TP-TX.P$1 JP2.2
  other vias: 33.01,64.11
VBATT  (via drill 0.51)
  Top 0.254: S1.4 S1.1 24.29,48.73 23.81,49.21 21.31,49.21 20.21,50.31 16.26,50.31 | JP1.2 16.21,55.61 15.91,55.31 15.91,54.65 | 15.91,54.65 15.91,52.61 16.26,52.26 16.26,50.31 | C10.1 13.61,48.81 13.81,49.01 16.16,49.01 U4.3 16.26,50.31 | 15.91,54.65 TP2.P$1
  other vias: 15.88,54.61
VCC  (via drill 0.51)
  Top 0.254: 23.91,55.11 23.91,53.71 24.21,53.41 U1.6 v30.41,53.41 32.21,53.41 | 23.91,55.11 23.91,55.31 23.26,55.96 C3.1 22.06,55.96 21.41,56.61 18.21,56.61 v17.21,57.61 | U1.4 24.01,55.01 23.91,55.11 | S1.5 S1.2 30.39,48.73 v30.41,48.71 | 39.21,57.21 C2.A | 39.21,57.21 v39.21,57.91 | 39.21,57.21 39.16,57.26 C1.1 35.36,57.26 34.91,56.81 34.91,54.71 34.41,54.21 U1.20 32.41,54.21 32.21,54.01 32.21,53.41 | v40.21,59.71 R2.2 | U1.18 32.51,52.61 32.21,52.91 32.21,53.41
  Bottom 0.254: v30.41,53.41 v30.41,48.71 | v40.21,59.71 40.21,58.91 v39.21,57.91 | U$45.1 12.81,52.21 12.84,52.21 13.97,53.34 13.97,54.37 v17.21,57.61

### Text on the board
Bottom: v12
tPlace: A4 | A3 | GND | A5 | A3 | A2 | - | B | G | + | 11 | On | Off | 10 | 5 | 6 | 9 | 9 | 5 | 6 | + | 10 | 11 | + | + | + | + | - | - | - | - | - | Released under the Creative Commons Attribution Share-Alike 3.0 License | http://creativecommons.org/licenses/by-sa/3.0 | L. Buechley | N. Seidle | P. Lewis